# Altium schematic sheet BackPlane.SchDoc
size A2; PageSetup: Record=PageOptions¦CenterHorizontal=True¦CenterVertical=True¦PrintScale=1.00¦XCorrection=1.00¦YCorrection=1.00¦PrintKind=1¦BorderSize=5000000¦LeftOffset=0¦BottomOffset=0¦Orientation=2¦PaperLength=1000¦PaperWidth=1000¦Scale=100¦PaperSource=7¦PrintQuality=-4¦MediaType=1¦DitherType=10¦PaperKind=ÐÅÖ½¦PrintScaleMode=1
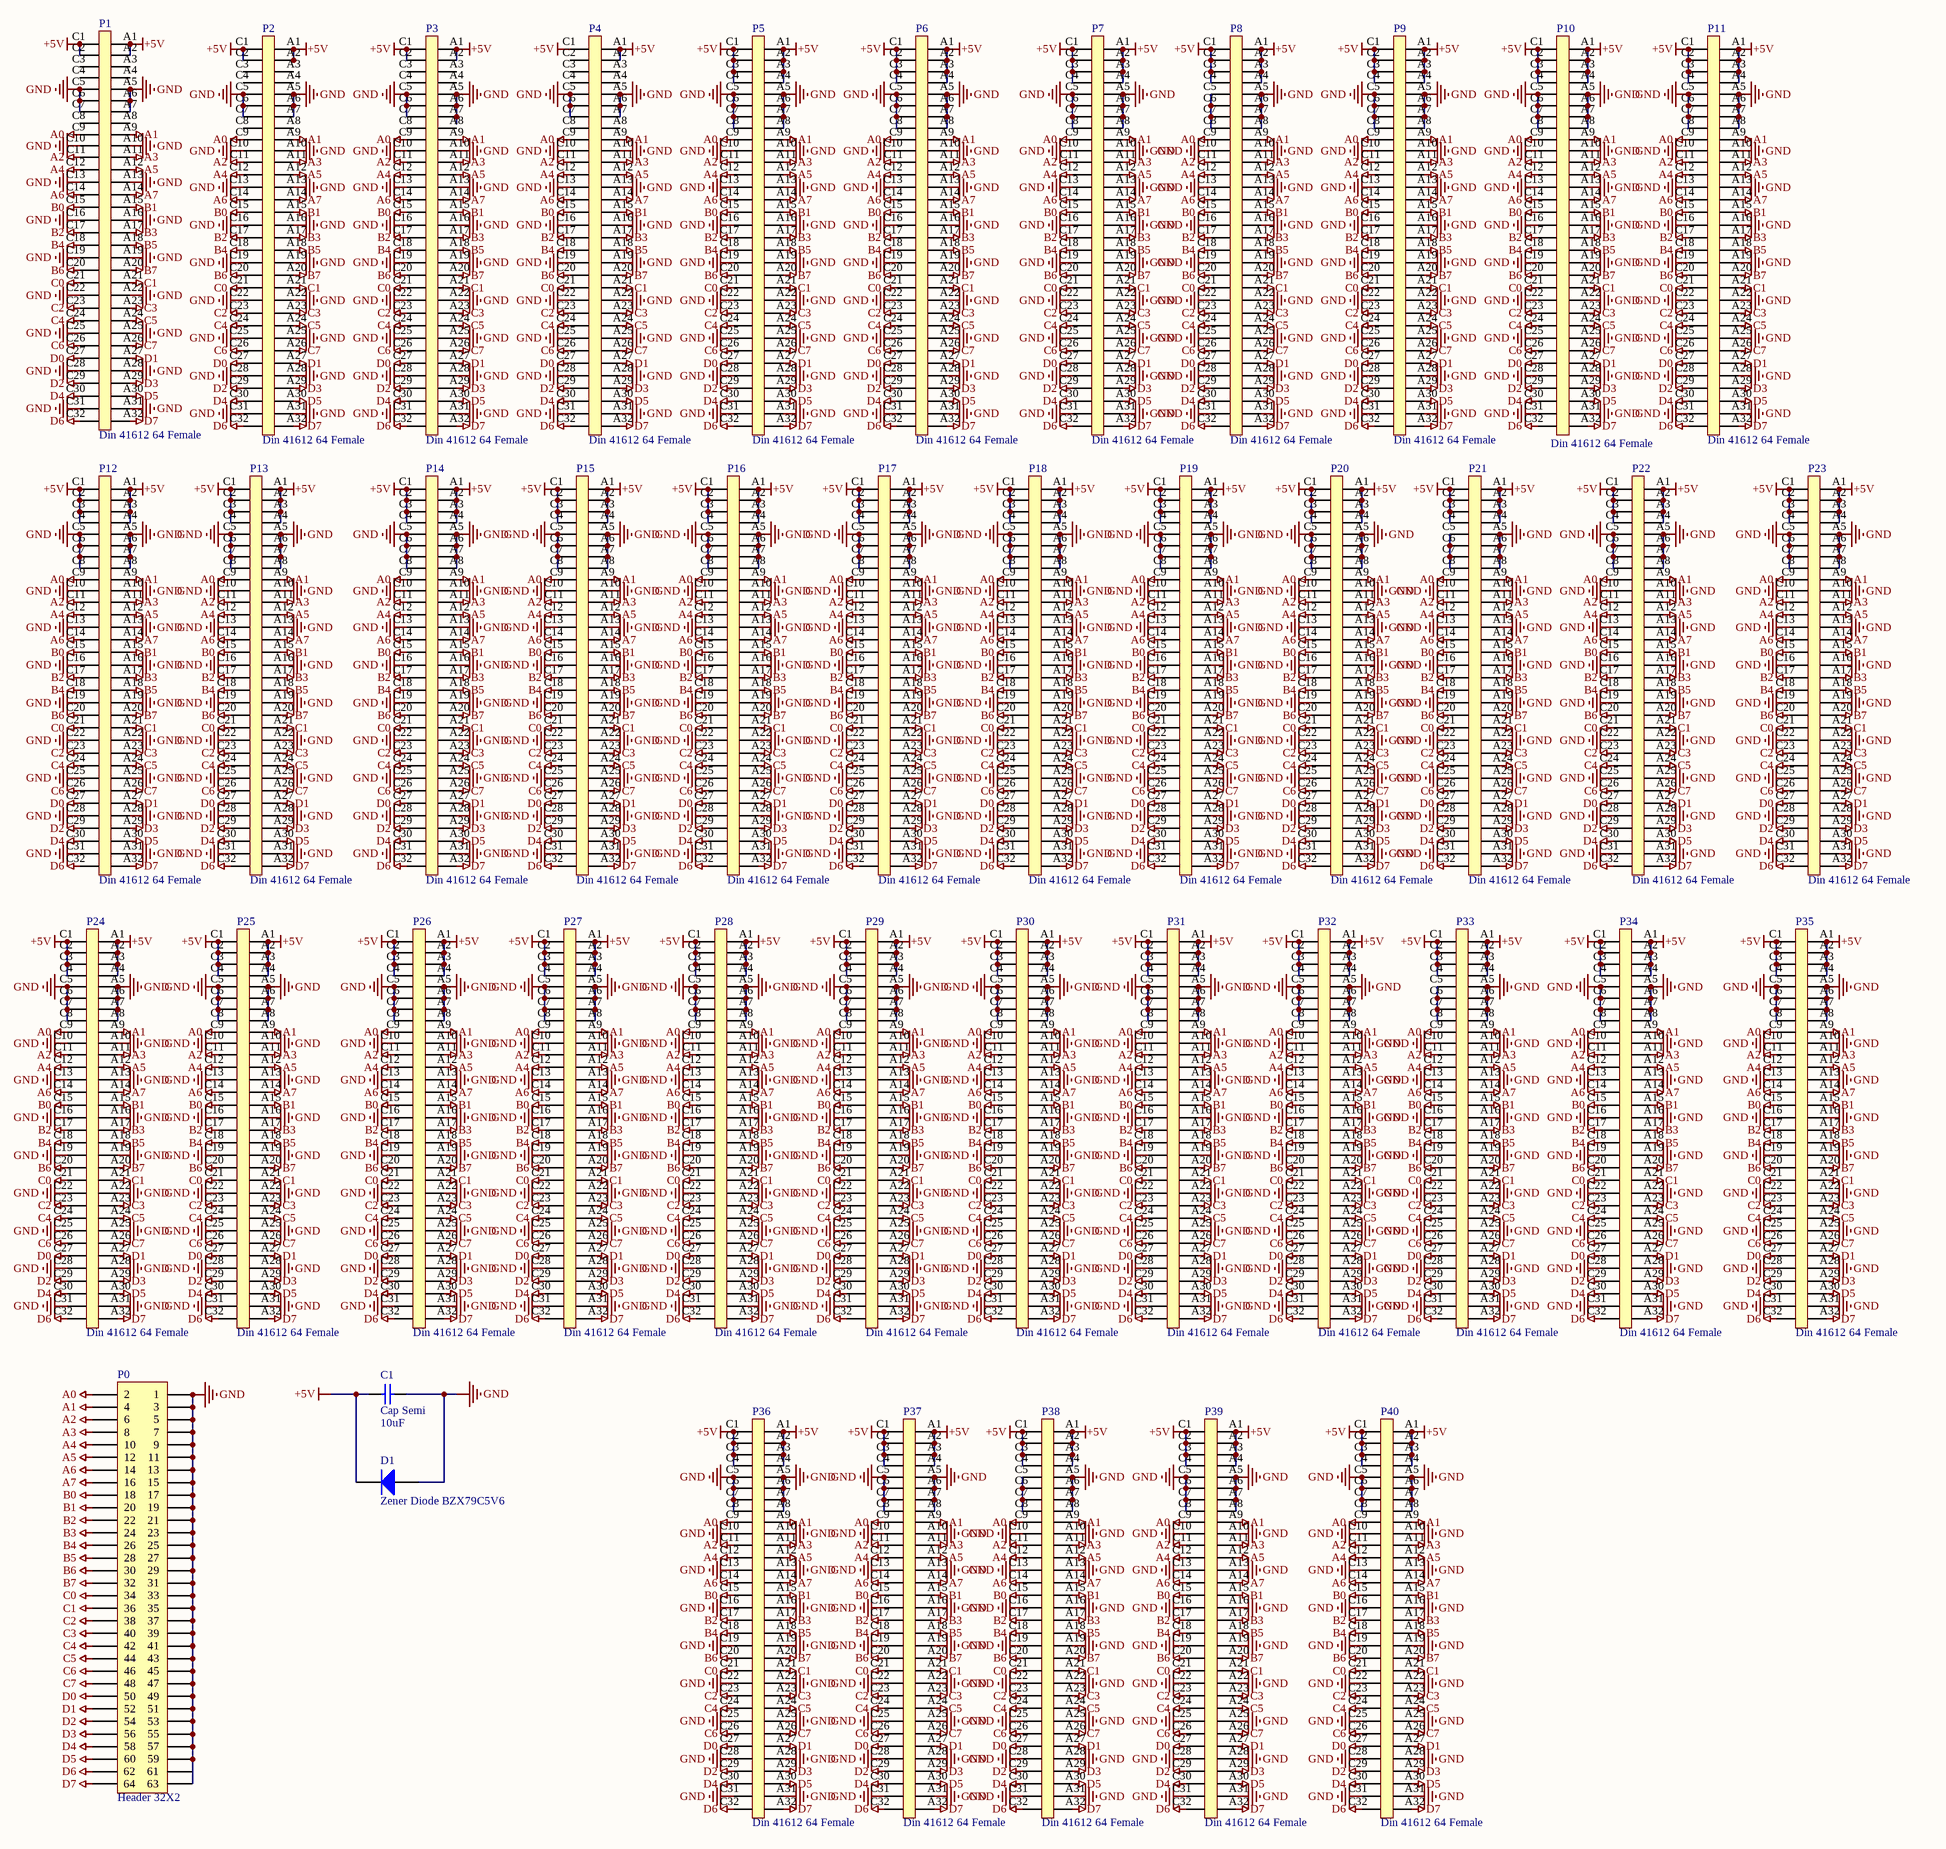
[diagram p0: BackPlane.SchDoc]

## Parts
C1  Cap Semi  value 10uF  [C1206]
D1  Zener Diode BZX79C5V6  [DO-35]
P0  Header 32X2  [HDR2X32]
P1  Din 41612 64 Female  [Female41612]
P2  Din 41612 64 Female  [Female41612]
P3  Din 41612 64 Female  [Female41612]
P4  Din 41612 64 Female  [Female41612]
P5  Din 41612 64 Female  [Female41612]
P6  Din 41612 64 Female  [Female41612]
P7  Din 41612 64 Female  [Female41612]
P8  Din 41612 64 Female  [Female41612]
P9  Din 41612 64 Female  [Female41612]
P10  Din 41612 64 Female  [Female41612]
P11  Din 41612 64 Female  [Female41612]
P12  Din 41612 64 Female  [Female41612]
P13  Din 41612 64 Female  [Female41612]
P14  Din 41612 64 Female  [Female41612]
P15  Din 41612 64 Female  [Female41612]
P16  Din 41612 64 Female  [Female41612]
P17  Din 41612 64 Female  [Female41612]
P18  Din 41612 64 Female  [Female41612]
P19  Din 41612 64 Female  [Female41612]
P20  Din 41612 64 Female  [Female41612]
P21  Din 41612 64 Female  [Female41612]
P22  Din 41612 64 Female  [Female41612]
P23  Din 41612 64 Female  [Female41612]
P24  Din 41612 64 Female  [Female41612]
P25  Din 41612 64 Female  [Female41612]
P26  Din 41612 64 Female  [Female41612]
P27  Din 41612 64 Female  [Female41612]
P28  Din 41612 64 Female  [Female41612]
P29  Din 41612 64 Female  [Female41612]
P30  Din 41612 64 Female  [Female41612]
P31  Din 41612 64 Female  [Female41612]
P32  Din 41612 64 Female  [Female41612]
P33  Din 41612 64 Female  [Female41612]
P34  Din 41612 64 Female  [Female41612]
P35  Din 41612 64 Female  [Female41612]
P36  Din 41612 64 Female  [Female41612]
P37  Din 41612 64 Female  [Female41612]
P38  Din 41612 64 Female  [Female41612]
P39  Din 41612 64 Female  [Female41612]
P40  Din 41612 64 Female  [Female41612]

## Nets
+5V: C1.1 D1.2(K) P1.A1 P1.A2(C33) P1.C1 P1.C2 P2.A1 P2.A2(C33) P2.C1 P2.C2 P3.A1 P3.A2(C33) P3.C1 P3.C2 P4.A1 P4.A2(C33) P4.C1 P5.A1 P5.A2(C33) P5.A3(C34) P5.A4 P5.C1 P5.C2 P5.C3 P5.C4 P6.A1 P6.A2(C33) P6.A3(C34) P6.A4 P6.C1 P6.C2 P6.C3 P6.C4 P7.A1 P7.A2(C33) P7.A3(C34) P7.A4 P7.C1 P7.C2 P7.C3 P7.C4 P8.A1 P8.A2(C33) P8.A3(C34) P8.A4 P8.C1 P8.C2 P8.C3 P8.C4 P9.A1 P9.A2(C33) P9.A3(C34) P9.A4 P9.C1 P9.C2 P9.C3 P9.C4 P10.A1 P10.A2(C33) P10.A3(C34) P10.A4 P10.C1 P10.C2 P10.C3 P10.C4 P11.A1 P11.A2(C33) P11.A3(C34) P11.A4 P11.C1 P11.C2 P11.C3 P11.C4 P12.A1 P12.A2(C33) P12.A3(C34) P12.A4 P12.C1 P12.C2 P12.C3 P12.C4 P13.A1 P13.A2(C33) P13.A3(C34) P13.A4 P13.C1 P13.C2 P13.C3 P13.C4 P14.A1 P14.A2(C33) P14.A3(C34) P14.A4 P14.C1 P14.C2 P14.C3 P14.C4 P15.A1 P15.A2(C33) P15.A3(C34) P15.A4 P15.C1 P15.C2 P15.C3 P15.C4 P16.A1 P16.A2(C33) P16.A3(C34) P16.A4 P16.C1 P16.C2 P16.C3 P16.C4 P17.A1 P17.A2(C33) P17.A3(C34) P17.A4 P17.C1 P17.C2 P17.C3 P17.C4 P18.A1 P18.A2(C33) P18.A3(C34) P18.A4 P18.C1 P18.C2 P18.C3 P18.C4 P19.A1 P19.A2(C33) P19.A3(C34) P19.A4 P19.C1 P19.C2 P19.C3 P19.C4 P20.A1 P20.A2(C33) P20.A3(C34) P20.A4 P20.C1 P20.C2 P20.C3 P20.C4 P21.A1 P21.A2(C33) P21.A3(C34) P21.A4 P21.C1 P21.C2 P21.C3 P21.C4 P22.A1 P22.A2(C33) P22.A3(C34) P22.A4 P22.C1 P22.C2 P22.C3 P22.C4 P23.A1 P23.A2(C33) P23.A3(C34) P23.A4 P23.C1 P23.C2 P23.C3 P23.C4 P24.A1 P24.A2(C33) P24.A3(C34) P24.A4 P24.C1 P24.C2 P24.C3 P24.C4 P25.A1 P25.A2(C33) P25.A3(C34) P25.A4 P25.C1 P25.C2 P25.C3 P25.C4 P26.A1 P26.A2(C33) P26.A3(C34) P26.A4 P26.C1 P26.C2 P26.C3 P26.C4 P27.A1 P27.A2(C33) P27.A3(C34) P27.A4 P27.C1 P27.C2 P27.C3 P27.C4 P28.A1 P28.A2(C33) P28.A3(C34) P28.A4 P28.C1 P28.C2 P28.C3 P28.C4 P29.A1 P29.A2(C33) P29.A3(C34) P29.A4 P29.C1 P29.C2 P29.C3 P29.C4 P30.A1 P30.A2(C33) P30.A3(C34) P30.A4 P30.C1 P30.C2 P30.C3 P30.C4 P31.A1 P31.A2(C33) P31.A3(C34) P31.A4 P31.C1 P31.C2 P31.C3 P31.C4 P32.A1 P32.A2(C33) P32.A3(C34) P32.A4 P32.C1 P32.C2 P32.C3 P32.C4 P33.A1 P33.A2(C33) P33.A3(C34) P33.A4 P33.C1 P33.C2 P33.C3 P33.C4 P34.A1 P34.A2(C33) P34.A3(C34) P34.A4 P34.C1 P34.C2 P34.C3 P34.C4 P35.A1 P35.A2(C33) P35.A3(C34) P35.A4 P35.C1 P35.C2 P35.C3 P35.C4 P36.A1 P36.A2(C33) P36.A3(C34) P36.A4 P36.C1 P36.C2 P36.C3 P36.C4 P37.A1 P37.A2(C33) P37.A3(C34) P37.A4 P37.C1 P37.C2 P37.C3 P37.C4 P38.A1 P38.A2(C33) P38.A3(C34) P38.A4 P38.C1 P38.C2 P38.C3 P38.C4 P39.A1 P39.A2(C33) P39.A3(C34) P39.A4 P39.C1 P39.C2 P39.C3 P39.C4 P40.A1 P40.A2(C33) P40.A3(C34) P40.A4 P40.C1 P40.C2 P40.C3 P40.C4
A0: P0.2 P1.C9 P2.C9 P3.C9 P4.C9 P5.C9 P6.C9 P7.C9 P8.C9 P9.C9 P10.C9 P11.C9 P12.C9 P13.C9 P14.C9 P15.C9 P16.C9 P17.C9 P18.C9 P19.C9 P20.C9 P21.C9 P22.C9 P23.C9 P24.C9 P25.C9 P26.C9 P27.C9 P28.C9 P29.C9 P30.C9 P31.C9 P32.C9 P33.C9 P34.C9 P35.C9 P36.C9 P37.C9 P38.C9 P39.C9 P40.C9
A1: P0.4 P1.A9 P2.A9 P3.A9 P4.A9 P5.A9 P6.A9 P7.A9 P8.A9 P9.A9 P10.A9 P11.A9 P12.A9 P13.A9 P14.A9 P15.A9 P16.A9 P17.A9 P18.A9 P19.A9 P20.A9 P21.A9 P22.A9 P23.A9 P24.A9 P25.A9 P26.A9 P27.A9 P28.A9 P29.A9 P30.A9 P31.A9 P32.A9 P33.A9 P34.A9 P35.A9 P36.A9 P37.A9 P38.A9 P39.A9 P40.A9
A2: P0.6 P1.C11 P2.C11 P3.C11 P4.C11 P5.C11 P6.C11 P7.C11 P8.C11 P9.C11 P10.C11 P11.C11 P12.C11 P13.C11 P14.C11 P15.C11 P16.C11 P17.C11 P18.C11 P19.C11 P20.C11 P21.C11 P22.C11 P23.C11 P24.C11 P25.C11 P26.C11 P27.C11 P28.C11 P29.C11 P30.C11 P31.C11 P32.C11 P33.C11 P34.C11 P35.C11 P36.C11 P37.C11 P38.C11 P39.C11 P40.C11
A3: P0.8 P1.A11 P2.A11 P3.A11 P4.A11 P5.A11 P6.A11 P7.A11 P8.A11 P9.A11 P10.A11 P11.A11 P12.A11 P13.A11 P14.A11 P15.A11 P16.A11 P17.A11 P18.A11 P19.A11 P20.A11 P21.A11 P22.A11 P23.A11 P24.A11 P25.A11 P26.A11 P27.A11 P28.A11 P29.A11 P30.A11 P31.A11 P32.A11 P33.A11 P34.A11 P35.A11 P36.A11 P37.A11 P38.A11 P39.A11 P40.A11
A4: P0.10 P1.C12 P2.C12 P3.C12 P4.C12 P5.C12 P6.C12 P7.C12 P8.C12 P9.C12 P10.C12 P11.C12 P12.C12 P13.C12 P14.C12 P15.C12 P16.C12 P17.C12 P18.C12 P19.C12 P20.C12 P21.C12 P22.C12 P23.C12 P24.C12 P25.C12 P26.C12 P27.C12 P28.C12 P29.C12 P30.C12 P31.C12 P32.C12 P33.C12 P34.C12 P35.C12 P36.C12 P37.C12 P38.C12 P39.C12 P40.C12
A5: P0.12 P1.A12 P2.A12 P3.A12 P4.A12 P5.A12 P6.A12 P7.A12 P8.A12 P9.A12 P10.A12 P11.A12 P12.A12 P13.A12 P14.A12 P15.A12 P16.A12 P17.A12 P18.A12 P19.A12 P20.A12 P21.A12 P22.A12 P23.A12 P24.A12 P25.A12 P26.A12 P27.A12 P28.A12 P29.A12 P30.A12 P31.A12 P32.A12 P33.A12 P34.A12 P35.A12 P36.A12 P37.A12 P38.A12 P39.A12 P40.A12
A6: P0.14 P1.C14 P2.C14 P3.C14 P4.C14 P5.C14 P6.C14 P7.C14 P8.C14 P9.C14 P10.C14 P11.C14 P12.C14 P13.C14 P14.C14 P15.C14 P16.C14 P17.C14 P18.C14 P19.C14 P20.C14 P21.C14 P22.C14 P23.C14 P24.C14 P25.C14 P26.C14 P27.C14 P28.C14 P29.C14 P30.C14 P31.C14 P32.C14 P33.C14 P34.C14 P35.C14 P36.C14 P37.C14 P38.C14 P39.C14 P40.C14
A7: P0.16 P1.A14 P2.A14 P3.A14 P4.A14 P5.A14 P6.A14 P7.A14 P8.A14 P9.A14 P10.A14 P11.A14 P12.A14 P13.A14 P14.A14 P15.A14 P16.A14 P17.A14 P18.A14 P19.A14 P20.A14 P21.A14 P22.A14 P23.A14 P24.A14 P25.A14 P26.A14 P27.A14 P28.A14 P29.A14 P30.A14 P31.A14 P32.A14 P33.A14 P34.A14 P35.A14 P36.A14 P37.A14 P38.A14 P39.A14 P40.A14
B0: P0.18 P1.C15 P2.C15 P3.C15 P4.C15 P5.C15 P6.C15 P7.C15 P8.C15 P9.C15 P10.C15 P11.C15 P12.C15 P13.C15 P14.C15 P15.C15 P16.C15 P17.C15 P18.C15 P19.C15 P20.C15 P21.C15 P22.C15 P23.C15 P24.C15 P25.C15 P26.C15 P27.C15 P28.C15 P29.C15 P30.C15 P31.C15 P32.C15 P33.C15 P34.C15 P35.C15 P36.C15 P37.C15 P38.C15 P39.C15 P40.C15
B1: P0.20 P1.A15 P2.A15 P3.A15 P4.A15 P5.A15 P6.A15 P7.A15 P8.A15 P9.A15 P10.A15 P11.A15 P12.A15 P13.A15 P14.A15 P15.A15 P16.A15 P17.A15 P18.A15 P19.A15 P20.A15 P21.A15 P22.A15 P23.A15 P24.A15 P25.A15 P26.A15 P27.A15 P28.A15 P29.A15 P30.A15 P31.A15 P32.A15 P33.A15 P34.A15 P35.A15 P36.A15 P37.A15 P38.A15 P39.A15 P40.A15
B2: P0.22 P1.C17 P2.C17 P3.C17 P4.C17 P5.C17 P6.C17 P7.C17 P8.C17 P9.C17 P10.C17 P11.C17 P12.C17 P13.C17 P14.C17 P15.C17 P16.C17 P17.C17 P18.C17 P19.C17 P20.C17 P21.C17 P22.C17 P23.C17 P24.C17 P25.C17 P26.C17 P27.C17 P28.C17 P29.C17 P30.C17 P31.C17 P32.C17 P33.C17 P34.C17 P35.C17 P36.C17 P37.C17 P38.C17 P39.C17 P40.C17
B3: P0.24 P1.A17 P2.A17 P3.A17 P4.A17 P5.A17 P6.A17 P7.A17 P8.A17 P9.A17 P10.A17 P11.A17 P12.A17 P13.A17 P14.A17 P15.A17 P16.A17 P17.A17 P18.A17 P19.A17 P20.A17 P21.A17 P22.A17 P23.A17 P24.A17 P25.A17 P26.A17 P27.A17 P28.A17 P29.A17 P30.A17 P31.A17 P32.A17 P33.A17 P34.A17 P35.A17 P36.A17 P37.A17 P38.A17 P39.A17 P40.A17
B4: P0.26 P1.C18 P2.C18 P3.C18 P4.C18 P5.C18 P6.C18 P7.C18 P8.C18 P9.C18 P10.C18 P11.C18 P12.C18 P13.C18 P14.C18 P15.C18 P16.C18 P17.C18 P18.C18 P19.C18 P20.C18 P21.C18 P22.C18 P23.C18 P24.C18 P25.C18 P26.C18 P27.C18 P28.C18 P29.C18 P30.C18 P31.C18 P32.C18 P33.C18 P34.C18 P35.C18 P36.C18 P37.C18 P38.C18 P39.C18 P40.C18
B5: P0.28 P1.A18 P2.A18 P3.A18 P4.A18 P5.A18 P6.A18 P7.A18 P8.A18 P9.A18 P10.A18 P11.A18 P12.A18 P13.A18 P14.A18 P15.A18 P16.A18 P17.A18 P18.A18 P19.A18 P20.A18 P21.A18 P22.A18 P23.A18 P24.A18 P25.A18 P26.A18 P27.A18 P28.A18 P29.A18 P30.A18 P31.A18 P32.A18 P33.A18 P34.A18 P35.A18 P36.A18 P37.A18 P38.A18 P39.A18 P40.A18
B6: P0.30 P1.C20 P2.C20 P3.C20 P4.C20 P5.C20 P6.C20 P7.C20 P8.C20 P9.C20 P10.C20 P11.C20 P12.C20 P13.C20 P14.C20 P15.C20 P16.C20 P17.C20 P18.C20 P19.C20 P20.C20 P21.C20 P22.C20 P23.C20 P24.C20 P25.C20 P26.C20 P27.C20 P28.C20 P29.C20 P30.C20 P31.C20 P32.C20 P33.C20 P34.C20 P35.C20 P36.C20 P37.C20 P38.C20 P39.C20 P40.C20
B7: P0.32 P1.A20 P2.A20 P3.A20 P4.A20 P5.A20 P6.A20 P7.A20 P8.A20 P9.A20 P10.A20 P11.A20 P12.A20 P13.A20 P14.A20 P15.A20 P16.A20 P17.A20 P18.A20 P19.A20 P20.A20 P21.A20 P22.A20 P23.A20 P24.A20 P25.A20 P26.A20 P27.A20 P28.A20 P29.A20 P30.A20 P31.A20 P32.A20 P33.A20 P34.A20 P35.A20 P36.A20 P37.A20 P38.A20 P39.A20 P40.A20
C0: P0.34 P1.C21 P2.C21 P3.C21 P4.C21 P5.C21 P6.C21 P7.C21 P8.C21 P9.C21 P10.C21 P11.C21 P12.C21 P13.C21 P14.C21 P15.C21 P16.C21 P17.C21 P18.C21 P19.C21 P20.C21 P21.C21 P22.C21 P23.C21 P24.C21 P25.C21 P26.C21 P27.C21 P28.C21 P29.C21 P30.C21 P31.C21 P32.C21 P33.C21 P34.C21 P35.C21 P36.C21 P37.C21 P38.C21 P39.C21 P40.C21
C1: P0.36 P1.A21 P2.A21 P3.A21 P4.A21 P5.A21 P6.A21 P7.A21 P8.A21 P9.A21 P10.A21 P11.A21 P12.A21 P13.A21 P14.A21 P15.A21 P16.A21 P17.A21 P18.A21 P19.A21 P20.A21 P21.A21 P22.A21 P23.A21 P24.A21 P25.A21 P26.A21 P27.A21 P28.A21 P29.A21 P30.A21 P31.A21 P32.A21 P33.A21 P34.A21 P35.A21 P36.A21 P37.A21 P38.A21 P39.A21 P40.A21
C2: P0.38 P1.C23 P2.C23 P3.C23 P4.C23 P5.C23 P6.C23 P7.C23 P8.C23 P9.C23 P10.C23 P11.C23 P12.C23 P13.C23 P14.C23 P15.C23 P16.C23 P17.C23 P18.C23 P19.C23 P20.C23 P21.C23 P22.C23 P23.C23 P24.C23 P25.C23 P26.C23 P27.C23 P28.C23 P29.C23 P30.C23 P31.C23 P32.C23 P33.C23 P34.C23 P35.C23 P36.C23 P37.C23 P38.C23 P39.C23 P40.C23
C3: P0.40 P1.A23 P2.A23 P3.A23 P4.A23 P5.A23 P6.A23 P7.A23 P8.A23 P9.A23 P10.A23 P11.A23 P12.A23 P13.A23 P14.A23 P15.A23 P16.A23 P17.A23 P18.A23 P19.A23 P20.A23 P21.A23 P22.A23 P23.A23 P24.A23 P25.A23 P26.A23 P27.A23 P28.A23 P29.A23 P30.A23 P31.A23 P32.A23 P33.A23 P34.A23 P35.A23 P36.A23 P37.A23 P38.A23 P39.A23 P40.A23
C4: P0.42 P1.C24 P2.C24 P3.C24 P4.C24 P5.C24 P6.C24 P7.C24 P8.C24 P9.C24 P10.C24 P11.C24 P12.C24 P13.C24 P14.C24 P15.C24 P16.C24 P17.C24 P18.C24 P19.C24 P20.C24 P21.C24 P22.C24 P23.C24 P24.C24 P25.C24 P26.C24 P27.C24 P28.C24 P29.C24 P30.C24 P31.C24 P32.C24 P33.C24 P34.C24 P35.C24 P36.C24 P37.C24 P38.C24 P39.C24 P40.C24
C5: P0.44 P1.A24 P2.A24 P3.A24 P4.A24 P5.A24 P6.A24 P7.A24 P8.A24 P9.A24 P10.A24 P11.A24 P12.A24 P13.A24 P14.A24 P15.A24 P16.A24 P17.A24 P18.A24 P19.A24 P20.A24 P21.A24 P22.A24 P23.A24 P24.A24 P25.A24 P26.A24 P27.A24 P28.A24 P29.A24 P30.A24 P31.A24 P32.A24 P33.A24 P34.A24 P35.A24 P36.A24 P37.A24 P38.A24 P39.A24 P40.A24
C6: P0.46 P1.C26 P2.C26 P3.C26 P4.C26 P5.C26 P6.C26 P7.C26 P8.C26 P9.C26 P10.C26 P11.C26 P12.C26 P13.C26 P14.C26 P15.C26 P16.C26 P17.C26 P18.C26 P19.C26 P20.C26 P21.C26 P22.C26 P23.C26 P24.C26 P25.C26 P26.C26 P27.C26 P28.C26 P29.C26 P30.C26 P31.C26 P32.C26 P33.C26 P34.C26 P35.C26 P36.C26 P37.C26 P38.C26 P39.C26 P40.C26
C7: P0.48 P1.A26 P2.A26 P3.A26 P4.A26 P5.A26 P6.A26 P7.A26 P8.A26 P9.A26 P10.A26 P11.A26 P12.A26 P13.A26 P14.A26 P15.A26 P16.A26 P17.A26 P18.A26 P19.A26 P20.A26 P21.A26 P22.A26 P23.A26 P24.A26 P25.A26 P26.A26 P27.A26 P28.A26 P29.A26 P30.A26 P31.A26 P32.A26 P33.A26 P34.A26 P35.A26 P36.A26 P37.A26 P38.A26 P39.A26 P40.A26
D0: P0.50 P1.C27 P2.C27 P3.C27 P4.C27 P5.C27 P6.C27 P7.C27 P8.C27 P9.C27 P10.C27 P11.C27 P12.C27 P13.C27 P14.C27 P15.C27 P16.C27 P17.C27 P18.C27 P19.C27 P20.C27 P21.C27 P22.C27 P23.C27 P24.C27 P25.C27 P26.C27 P27.C27 P28.C27 P29.C27 P30.C27 P31.C27 P32.C27 P33.C27 P34.C27 P35.C27 P36.C27 P37.C27 P38.C27 P39.C27 P40.C27
D1: P0.52 P1.A27 P2.A27 P3.A27 P4.A27 P5.A27 P6.A27 P7.A27 P8.A27 P9.A27 P10.A27 P11.A27 P12.A27 P13.A27 P14.A27 P15.A27 P16.A27 P17.A27 P18.A27 P19.A27 P20.A27 P21.A27 P22.A27 P23.A27 P24.A27 P25.A27 P26.A27 P27.A27 P28.A27 P29.A27 P30.A27 P31.A27 P32.A27 P33.A27 P34.A27 P35.A27 P36.A27 P37.A27 P38.A27 P39.A27 P40.A27
D2: P0.54 P1.C29 P2.C29 P3.C29 P4.C29 P5.C29 P6.C29 P7.C29 P8.C29 P9.C29 P10.C29 P11.C29 P12.C29 P13.C29 P14.C29 P15.C29 P16.C29 P17.C29 P18.C29 P19.C29 P20.C29 P21.C29 P22.C29 P23.C29 P24.C29 P25.C29 P26.C29 P27.C29 P28.C29 P29.C29 P30.C29 P31.C29 P32.C29 P33.C29 P34.C29 P35.C29 P36.C29 P37.C29 P38.C29 P39.C29 P40.C29
D3: P0.56 P1.A29 P2.A29 P3.A29 P4.A29 P5.A29 P6.A29 P7.A29 P8.A29 P9.A29 P10.A29 P11.A29 P12.A29 P13.A29 P14.A29 P15.A29 P16.A29 P17.A29 P18.A29 P19.A29 P20.A29 P21.A29 P22.A29 P23.A29 P24.A29 P25.A29 P26.A29 P27.A29 P28.A29 P29.A29 P30.A29 P31.A29 P32.A29 P33.A29 P34.A29 P35.A29 P36.A29 P37.A29 P38.A29 P39.A29 P40.A29
D4: P0.58 P1.C30 P2.C30 P3.C30 P4.C30 P5.C30 P6.C30 P7.C30 P8.C30 P9.C30 P10.C30 P11.C30 P12.C30 P13.C30 P14.C30 P15.C30 P16.C30 P17.C30 P18.C30 P19.C30 P20.C30 P21.C30 P22.C30 P23.C30 P24.C30 P25.C30 P26.C30 P27.C30 P28.C30 P29.C30 P30.C30 P31.C30 P32.C30 P33.C30 P34.C30 P35.C30 P36.C30 P37.C30 P38.C30 P39.C30 P40.C30
D5: P0.60 P1.A30 P2.A30 P3.A30 P4.A30 P5.A30 P6.A30 P7.A30 P8.A30 P9.A30 P10.A30 P11.A30 P12.A30 P13.A30 P14.A30 P15.A30 P16.A30 P17.A30 P18.A30 P19.A30 P20.A30 P21.A30 P22.A30 P23.A30 P24.A30 P25.A30 P26.A30 P27.A30 P28.A30 P29.A30 P30.A30 P31.A30 P32.A30 P33.A30 P34.A30 P35.A30 P36.A30 P37.A30 P38.A30 P39.A30 P40.A30
D6: P0.62 P1.C32 P2.C32 P3.C32 P4.C32 P5.C32 P6.C32 P7.C32 P8.C32 P9.C32 P10.C32 P11.C32 P12.C32 P13.C32 P14.C32 P15.C32 P16.C32 P17.C32 P18.C32 P19.C32 P20.C32 P21.C32 P22.C32 P23.C32 P24.C32 P25.C32 P26.C32 P27.C32 P28.C32 P29.C32 P30.C32 P31.C32 P32.C32 P33.C32 P34.C32 P35.C32 P36.C32 P37.C32 P38.C32 P39.C32 P40.C32
D7: P0.64 P1.A32 P2.A32 P3.A32 P4.A32 P5.A32 P6.A32 P7.A32 P8.A32 P9.A32 P10.A32 P11.A32 P12.A32 P13.A32 P14.A32 P15.A32 P16.A32 P17.A32 P18.A32 P19.A32 P20.A32 P21.A32 P22.A32 P23.A32 P24.A32 P25.A32 P26.A32 P27.A32 P28.A32 P29.A32 P30.A32 P31.A32 P32.A32 P33.A32 P34.A32 P35.A32 P36.A32 P37.A32 P38.A32 P39.A32 P40.A32
GND: C1.2 D1.1(A) P0.1 P0.3 P0.5 P0.7 P0.9 P0.11 P0.13 P0.15 P0.17 P0.19 P0.21 P0.23 P0.25 P0.27 P0.29 P0.31 P0.33 P0.35 P0.37 P0.39 P0.41 P0.43 P0.45 P0.47 P0.49 P0.51 P0.53 P0.55 P0.57 P0.59 P0.61 P0.63 P1.A5 P1.A6 P1.A7 P1.A10 P1.A13 P1.A16 P1.A19 P1.A22 P1.A25 P1.A28 P1.A31 P1.C5 P1.C6 P1.C7 P1.C10 P1.C13 P1.C16 P1.C19 P1.C22 P1.C25 P1.C28 P1.C31 P2.A5 P2.A6 P2.A7 P2.A10 P2.A13 P2.A16 P2.A19 P2.A22 P2.A25 P2.A28 P2.A31 P2.C5 P2.C6 P2.C7 P2.C10 P2.C13 P2.C16 P2.C19 P2.C22 P2.C25 P2.C28 P2.C31 P3.A5 P3.A6 P3.A7 P3.A10 P3.A13 P3.A16 P3.A19 P3.A22 P3.A25 P3.A28 P3.A31 P3.C5 P3.C6 P3.C7 P3.C10 P3.C13 P3.C16 P3.C19 P3.C22 P3.C25 P3.C28 P3.C31 P4.A5 P4.A6 P4.A7 P4.A10 P4.A13 P4.A16 P4.A19 P4.A22 P4.A25 P4.A28 P4.A31 P4.C5 P4.C6 P4.C7 P4.C10 P4.C13 P4.C16 P4.C19 P4.C22 P4.C25 P4.C28 P4.C31 P5.A5 P5.A6 P5.A7 P5.A8 P5.A10 P5.A13 P5.A16 P5.A19 P5.A22 P5.A25 P5.A28 P5.A31 P5.C5 P5.C6 P5.C7 P5.C8 P5.C10 P5.C13 P5.C16 P5.C19 P5.C22 P5.C25 P5.C28 P5.C31 P6.A5 P6.A6 P6.A7 P6.A8 P6.A10 P6.A13 P6.A16 P6.A19 P6.A22 P6.A25 P6.A28 P6.A31 P6.C5 P6.C6 P6.C7 P6.C8 P6.C10 P6.C13 P6.C16 P6.C19 P6.C22 P6.C25 P6.C28 P6.C31 P7.A5 P7.A6 P7.A7 P7.A8 P7.A10 P7.A13 P7.A16 P7.A19 P7.A22 P7.A25 P7.A28 P7.A31 P7.C5 P7.C6 P7.C7 P7.C8 P7.C10 P7.C13 P7.C16 P7.C19 P7.C22 P7.C25 P7.C28 P7.C31 P8.A5 P8.A6 P8.A7 P8.A8 P8.A10 P8.A13 P8.A16 P8.A19 P8.A22 P8.A25 P8.A28 P8.A31 P8.C10 P8.C13 P8.C16 P8.C19 P8.C22 P8.C25 P8.C28 P8.C31 P9.A5 P9.A6 P9.A7 P9.A8 P9.A10 P9.A13 P9.A16 P9.A19 P9.A22 P9.A25 P9.A28 P9.A31 P9.C5 P9.C6 P9.C7 P9.C8 P9.C10 P9.C13 P9.C16 P9.C19 P9.C22 P9.C25 P9.C28 P9.C31 P10.A5 P10.A6 P10.A7 P10.A8 P10.A10 P10.A13 P10.A16 P10.A19 P10.A22 P10.A25 P10.A28 P10.A31 P10.C5 P10.C6 P10.C7 P10.C8 P10.C10 P10.C13 P10.C16 P10.C19 P10.C22 P10.C25 P10.C28 P10.C31 P11.A5 P11.A6 P11.A7 P11.A8 P11.A10 P11.A13 P11.A16 P11.A19 P11.A22 P11.A25 P11.A28 P11.A31 P11.C5 P11.C6 P11.C7 P11.C8 P11.C10 P11.C13 P11.C16 P11.C19 P11.C22 P11.C25 P11.C28 P11.C31 P12.A5 P12.A6 P12.A7 P12.A8 P12.A10 P12.A13 P12.A16 P12.A19 P12.A22 P12.A25 P12.A28 P12.A31 P12.C5 P12.C6 P12.C7 P12.C8 P12.C10 P12.C13 P12.C16 P12.C19 P12.C22 P12.C25 P12.C28 P12.C31 P13.A5 P13.A6 P13.A7 P13.A8 P13.A10 P13.A13 P13.A16 P13.A19 P13.A22 P13.A25 P13.A28 P13.A31 P13.C5 P13.C6 P13.C7 P13.C8 P13.C10 P13.C13 P13.C16 P13.C19 P13.C22 P13.C25 P13.C28 P13.C31 P14.A5 P14.A6 P14.A7 P14.A8 P14.A10 P14.A13 P14.A16 P14.A19 P14.A22 P14.A25 P14.A28 P14.A31 P14.C5 P14.C6 P14.C7 P14.C8 P14.C10 P14.C13 P14.C16 P14.C19 P14.C22 P14.C25 P14.C28 P14.C31 P15.A5 P15.A6 P15.A7 P15.A8 P15.A10 P15.A13 P15.A16 P15.A19 P15.A22 P15.A25 P15.A28 P15.A31 P15.C5 P15.C6 P15.C7 P15.C8 P15.C10 P15.C13 P15.C16 P15.C19 P15.C22 P15.C25 P15.C28 P15.C31 P16.A5 P16.A6 P16.A7 P16.A8 P16.A10 P16.A13 P16.A16 P16.A19 P16.A22 P16.A25 P16.A28 P16.A31 P16.C5 P16.C6 P16.C7 P16.C8 P16.C10 P16.C13 P16.C16 P16.C19 P16.C22 P16.C25 P16.C28 P16.C31 P17.A5 P17.A6 P17.A7 P17.A8 P17.A10 P17.A13 P17.A16 P17.A19 P17.A22 P17.A25 P17.A28 P17.A31 P17.C5 P17.C6 P17.C7 P17.C8 P17.C10 P17.C13 P17.C16 P17.C19 P17.C22 P17.C25 P17.C28 P17.C31 P18.A5 P18.A6 P18.A7 P18.A8 P18.A10 P18.A13 P18.A16 P18.A19 P18.A22 P18.A25 P18.A28 P18.A31 P18.C5 P18.C6 P18.C7 P18.C8 P18.C10 P18.C13 P18.C16 P18.C19 P18.C22 P18.C25 P18.C28 P18.C31 P19.A5 P19.A6 P19.A7 P19.A8 P19.A10 P19.A13 P19.A16 P19.A19 P19.A22 P19.A25 P19.A28 P19.A31 P19.C5 P19.C6 P19.C7 P19.C8 P19.C10 P19.C13 P19.C16 P19.C19 P19.C22 P19.C25 P19.C28 P19.C31 P20.A5 P20.A6 P20.A7 P20.A8 P20.A10 P20.A13 P20.A16 P20.A19 P20.A22 P20.A25 P20.A28 P20.A31 P20.C5 P20.C6 P20.C7 P20.C8 P20.C10 P20.C13 P20.C16 P20.C19 P20.C22 P20.C25 P20.C28 P20.C31 P21.A5 P21.A6 P21.A7 P21.A8 P21.A10 P21.A13 P21.A16 P21.A19 P21.A22 P21.A25 P21.A28 P21.A31 P21.C10 P21.C13 P21.C16 P21.C19 P21.C22 P21.C25 P21.C28 P21.C31 P22.A5 P22.A6 P22.A7 P22.A8 P22.A10 P22.A13 P22.A16 P22.A19 P22.A22 P22.A25 P22.A28 P22.A31 P22.C5 P22.C6 P22.C7 P22.C8 P22.C10 P22.C13 P22.C16 P22.C19 P22.C22 P22.C25 P22.C28 P22.C31 P23.A5 P23.A6 P23.A7 P23.A8 P23.A10 P23.A13 P23.A16 P23.A19 P23.A22 P23.A25 P23.A28 P23.A31 P23.C5 P23.C6 P23.C7 P23.C8 P23.C10 P23.C13 P23.C16 P23.C19 P23.C22 P23.C25 P23.C28 P23.C31 P24.A5 P24.A6 P24.A7 P24.A8 P24.A10 P24.A13 P24.A16 P24.A19 P24.A22 P24.A25 P24.A28 P24.A31 P24.C5 P24.C6 P24.C7 P24.C8 P24.C10 P24.C13 P24.C16 P24.C19 P24.C22 P24.C25 P24.C28 P24.C31 P25.A5 P25.A6 P25.A7 P25.A8 P25.A10 P25.A13 P25.A16 P25.A19 P25.A22 P25.A25 P25.A28 P25.A31 P25.C5 P25.C6 P25.C7 P25.C8 P25.C10 P25.C13 P25.C16 P25.C19 P25.C22 P25.C25 P25.C28 P25.C31 P26.A5 P26.A6 P26.A7 P26.A8 P26.A10 P26.A13 P26.A16 P26.A19 P26.A22 P26.A25 P26.A28 P26.A31 P26.C5 P26.C6 P26.C7 P26.C8 P26.C10 P26.C13 P26.C16 P26.C19 P26.C22 P26.C25 P26.C28 P26.C31 P27.A5 P27.A6 P27.A7 P27.A8 P27.A10 P27.A13 P27.A16 P27.A19 P27.A22 P27.A25 P27.A28 P27.A31 P27.C5 P27.C6 P27.C7 P27.C8 P27.C10 P27.C13 P27.C16 P27.C19 P27.C22 P27.C25 P27.C28 P27.C31 P28.A5 P28.A6 P28.A7 P28.A8 P28.A10 P28.A13 P28.A16 P28.A19 P28.A22 P28.A25 P28.A28 P28.A31 P28.C5 P28.C6 P28.C7 P28.C8 P28.C10 P28.C13 P28.C16 P28.C19 P28.C22 P28.C25 P28.C28 P28.C31 P29.A5 P29.A6 P29.A7 P29.A8 P29.A10 P29.A13 P29.A16 P29.A19 P29.A22 P29.A25 P29.A28 P29.A31 P29.C5 P29.C6 P29.C7 P29.C8 P29.C10 P29.C13 P29.C16 P29.C19 P29.C22 P29.C25 P29.C28 P29.C31 P30.A5 P30.A6 P30.A7 P30.A8 P30.A10 P30.A13 P30.A16 P30.A19 P30.A22 P30.A25 P30.A28 P30.A31 P30.C5 P30.C6 P30.C7 P30.C8 P30.C10 P30.C13 P30.C16 P30.C19 P30.C22 P30.C25 P30.C28 P30.C31 P31.A5 P31.A6 P31.A7 P31.A8 P31.A10 P31.A13 P31.A16 P31.A19 P31.A22 P31.A25 P31.A28 P31.A31 P31.C5 P31.C6 P31.C7 P31.C8 P31.C10 P31.C13 P31.C16 P31.C19 P31.C22 P31.C25 P31.C28 P31.C31 P32.A5 P32.A6 P32.A7 P32.A8 P32.A10 P32.A13 P32.A16 P32.A19 P32.A22 P32.A25 P32.A28 P32.A31 P32.C5 P32.C6 P32.C7 P32.C8 P32.C10 P32.C13 P32.C16 P32.C19 P32.C22 P32.C25 P32.C28 P32.C31 P33.A5 P33.A6 P33.A7 P33.A8 P33.A10 P33.A13 P33.A16 P33.A19 P33.A22 P33.A25 P33.A28 P33.A31 P33.C10 P33.C13 P33.C16 P33.C19 P33.C22 P33.C25 P33.C28 P33.C31 P34.A5 P34.A6 P34.A7 P34.A8 P34.A10 P34.A13 P34.A16 P34.A19 P34.A22 P34.A25 P34.A28 P34.A31 P34.C5 P34.C6 P34.C7 P34.C8 P34.C10 P34.C13 P34.C16 P34.C19 P34.C22 P34.C25 P34.C28 P34.C31 P35.A5 P35.A6 P35.A7 P35.A8 P35.A10 P35.A13 P35.A16 P35.A19 P35.A22 P35.A25 P35.A28 P35.A31 P35.C5 P35.C6 P35.C7 P35.C8 P35.C10 P35.C13 P35.C16 P35.C19 P35.C22 P35.C25 P35.C28 P35.C31 P36.A5 P36.A6 P36.A7 P36.A8 P36.A10 P36.A13 P36.A16 P36.A19 P36.A22 P36.A25 P36.A28 P36.A31 P36.C5 P36.C6 P36.C7 P36.C8 P36.C10 P36.C13 P36.C16 P36.C19 P36.C22 P36.C25 P36.C28 P36.C31 P37.A5 P37.A6 P37.A7 P37.A8 P37.A10 P37.A13 P37.A16 P37.A19 P37.A22 P37.A25 P37.A28 P37.A31 P37.C5 P37.C6 P37.C7 P37.C8 P37.C10 P37.C13 P37.C16 P37.C19 P37.C22 P37.C25 P37.C28 P37.C31 P38.A5 P38.A6 P38.A7 P38.A8 P38.A10 P38.A13 P38.A16 P38.A19 P38.A22 P38.A25 P38.A28 P38.A31 P38.C10 P38.C13 P38.C16 P38.C19 P38.C22 P38.C25 P38.C28 P38.C31 P39.A5 P39.A6 P39.A7 P39.A8 P39.A10 P39.A13 P39.A16 P39.A19 P39.A22 P39.A25 P39.A28 P39.A31 P39.C5 P39.C6 P39.C7 P39.C8 P39.C10 P39.C13 P39.C16 P39.C19 P39.C22 P39.C25 P39.C28 P39.C31 P40.A5 P40.A6 P40.A7 P40.A8 P40.A10 P40.A13 P40.A16 P40.A19 P40.A22 P40.A25 P40.A28 P40.A31 P40.C5 P40.C6 P40.C7 P40.C8 P40.C10 P40.C13 P40.C16 P40.C19 P40.C22 P40.C25 P40.C28 P40.C31
NetP8_C5: P8.C5 P8.C6 P8.C7 P8.C8
NetP21_C5: P21.C5 P21.C6 P21.C7 P21.C8
NetP33_C5: P33.C5 P33.C6 P33.C7 P33.C8
NetP38_C5: P38.C5 P38.C6 P38.C7 P38.C8

Not connected (* = marked no-connect by the designer): P1 A3(C34) A4 A8 C3(3) C4(4) C8(8); P2 A3(C34) A4 A8 C3(3) C4(4) C8(8); P3 A3(C34) A4 A8 C3(3) C4(4) C8(8); P4 A3(C34) A4 A8 C2(2) C3(3) C4(4) C8(8)

## Library data of the parts
C1 = Cap Semi: Capacitor (Semiconductor SIM Model); Published: 8-Jun-2000; LatestRevisionDate: 29-May-2009; LatestRevisionNote: IPC-7351 Footprint Added.; PackageReference: C1206; Publisher: Altium Limited; PackageDescription: Chip Capacitor
D1 = Diode 1N914: High Conductance Fast Diode; Published: 8-Jun-2000; LatestRevisionDate: 17-Jul-2002; LatestRevisionNote: Re-released for DXP Platform.; DatasheetVersion: 1997; PackageReference: DO-35; Publisher: Altium Limited; PackageDescription: Diode, Axial; Body 3.8 x 1.9 mm (LxDia. max), Lead Dia. 0.53 mm (max); Code_JEDEC: DO-204-AH; ComponentLink1Description: Manufacturer Link; ComponentLink1URL: http://www.fairchildsemi.com/; ComponentLink2Description: Datasheet; ComponentLink2URL: http://www.fairchildsemi.com/ds/1N%2F1N4448.pdf
P0 = Header 32X2: Header, 30-Pin, Dual row; LatestRevisionDate: 17-Jul-2002; LatestRevisionNote: Re-released for DXP Platform.; Publisher: Altium Limited